# EAGLE design rso (EAGLE 9.4.2)
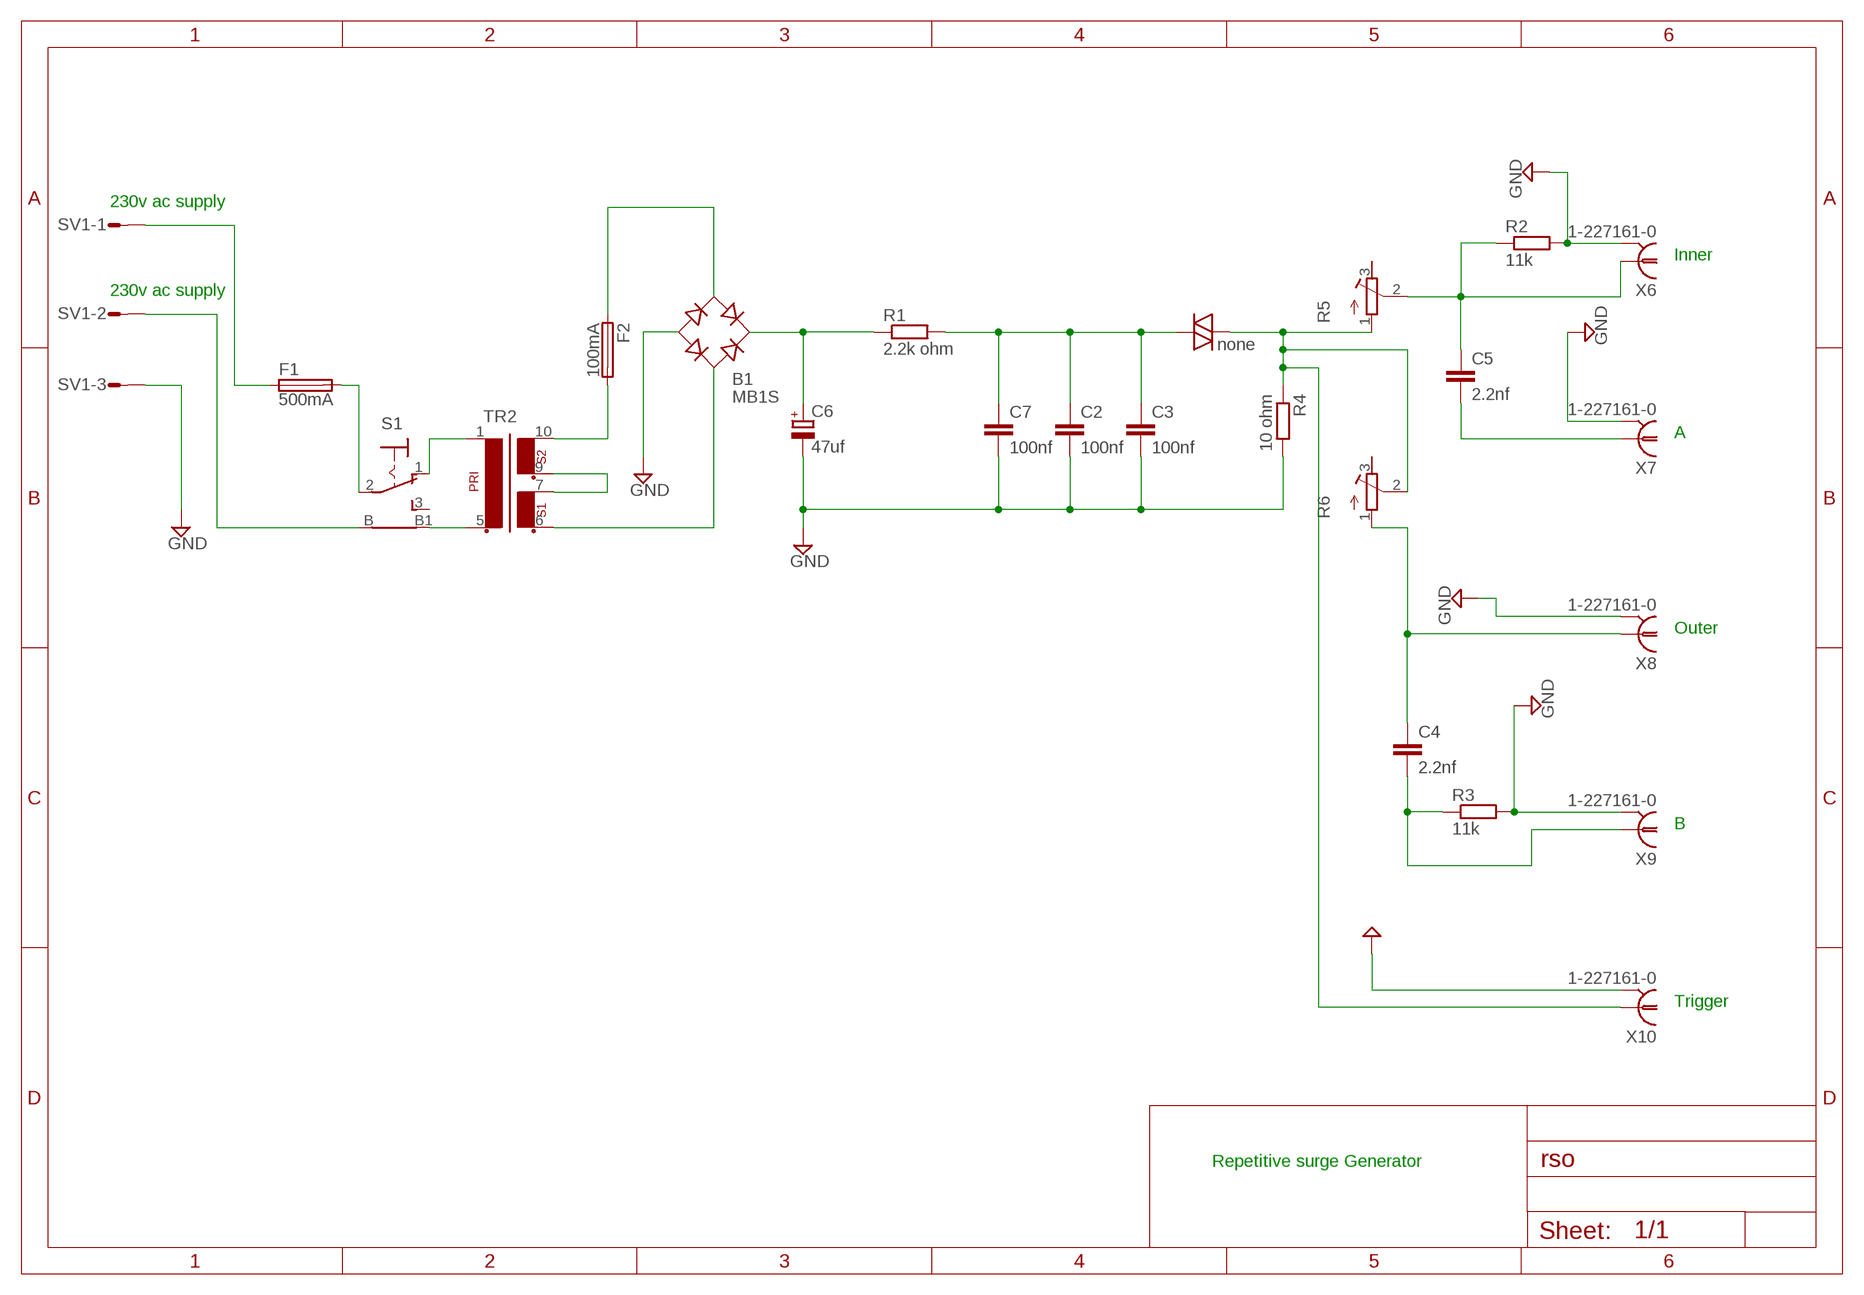
[diagram p0: schematic, sheet 1]

## Parts
B1  MB1S  [SOIC-4]
C2  100nf  C-EUC0805  [C0805]
C3  100nf  C-EUC0805  [C0805]
C4  2.2nf  C-EUC0805  [C0805]
C5  2.2nf  C-EUC0805  [C0805]
C6  47uf  CPOL-EU140CLH-1010  [140CLH-1010]
C7  100nf  C-EUC0805  [C0805]
D1  none  DIAC-DO35-10  [DO35-10]
F1  500mA  SH22,5A  [SH22,5A]
F2  100mA  SH22,5A  [SH22,5A]
R1  2.2k ohm  R-EU_R2512W  [R2512W]
R2  11k  R-EU_M0805  [M0805]
R3  11k  R-EU_M0805  [M0805]
R4  10 ohm  R-EU_M0805  [M0805]
R5  R-TRIMM3339P  [RTRIM3339P]
R6  R-TRIMM3339P  [RTRIM3339P]
S1  LPV-1  [LPV-1]
SV1  L03P  [L03P]
TR2  EI38-2  [EI38-2]
X6  1-227161-0  [AMP_227161]
X7  1-227161-0  [AMP_227161]
X8  1-227161-0  [AMP_227161]
X9  1-227161-0  [AMP_227161]
X10  1-227161-0  [AMP_227161]

## Nets
GND: B1.- C2.2 C3.2 C6.- C7.2 R2.2 R3.2 R4.2 SV1.3 X6.2 X7.2 X8.2 X9.2 X10.2
N$1: B1.~1(AC1) F2.1
N$2: B1.~2(AC2) TR2.6
N$3: TR2.7 TR2.9
N$4: S1.B SV1.2
N$5: F1.1 SV1.1
N$6: F1.2 S1.2(P)
N$7: S1.B1 TR2.5
N$8: S1.1(O) TR2.1
N$9: B1.+ C6.+ R1.1
N$10: C4.2 R3.1 X9.1
N$11: C2.1 C3.1 C7.1 D1.A R1.2
N$12: D1.C R4.1 R5.1(A) R6.2(S) X10.1
N$13: C4.1 R6.1(A) X8.1
N$14: C5.1 R2.1 R5.2(S) X6.1
N$15: C5.2 X7.1
N$16: F2.2 TR2.10
Unconnected: R5.3(E) R6.3(E) S1.3(S)

## Notes on the sheet
- 230v ac supply
- Inner
- 230v ac supply
- A
- Outer
- B
- Trigger
- Repetitive surge Generator

## Library data of the parts
B1 = rectifier:MB*S: Bridge Rectifier Source: http://www.fairchildsemi.com/ds/MB/MB6S.pdf; MF: MULTICOMP; MPN: MB1S; OC_FARNELL: 1861514
C2 C3 C7 = rcl:C-EU: CAPACITOR, European symbol; MF: AVX; MPN: 08055C104KAZ2A; OC_FARNELL: 7569564; SPICEPREFIX: C
C4 C5 = rcl:C-EU: CAPACITOR, European symbol; MF: AVX; MPN: 04025C222JAT2A; OC_FARNELL: 1740585; SPICEPREFIX: C
C6 = rcl:CPOL-EU: POLARIZED CAPACITOR, European symbol; MF: PANASONIC; MPN: EEEFK1K470P; OC_FARNELL: 9696105; SPICEPREFIX: C
D1 = diode:DIAC-: DIAC; MF: NTE ELECTRONICS; MPN: NTE6408; OC_FARNELL: 1530937
F1 F2 = fuse:SH22,5A: FUSE HOLDER grid 22,5mm, isolated cap OGN0031 8201, Schurter (Buerklin); MF: ARCOLECTRIC; MPN: C0345RAAAA; OC_FARNELL: 149862; OC_NEWARK: 04F1224
R1 = rcl:R-EU_: RESISTOR, European symbol; MF: VISHAY; MPN: CRCW08052K20FKEA; OC_FARNELL: 1469887; RS_NUMBER: 178-1862; SPICEPREFIX: R
R2 R3 = rcl:R-EU_: RESISTOR, European symbol; MF: MULTICOMP; MPN: MCMR08X1102FTL; OC_FARNELL: 2073617RL; SPICEPREFIX: R
R4 = rcl:R-EU_: RESISTOR, European symbol; MF: BOURNS; MPN: CRT1206-BY-10R0ELF; OC_FARNELL: 2008318; SPICEPREFIX: R
R5 R6 = rcl:R-TRIMM: Trimm resistor; MF: VISHAY; MPN: 534B1101JL; OC_FARNELL: 1144784; SPICEMODEL: X; SPICEPREFIXL: POT
S1 = switch:LPV-1: TOGGLE SWITCH; MF: QUALTEK ELECTRONICS; MPN: 761-18/003; OC_FARNELL: 1425202
SV1 = con-amp-mt:L03P: AMP MT CONNECTOR; MF: JST (JAPAN SOLDERLESS TERMINALS); MPN: B03B-XASK-1(LF)(SN); OC_FARNELL: 9492070; OC_NEWARK: unknown
TR2 = trafo:EI38-2: TRANSFORMER 1 primary winding, 2 secondary windings ERA; MF: MYRRA; MPN: 44203; OC_FARNELL: 1214596
X6-X10 = con-coax:?227161*: JACK, RIGHT ANGLE, 50 OHM, PCB, BNC Source: amp_227161.pdf; MF: GREENPAR - TE CONNECTIVITY; MPN: 1-1337542-0; OC_FARNELL: 1020954; OC_NEWARK: 33B3200

## Net classes
0 default: clearance 0.205 mm

## Board
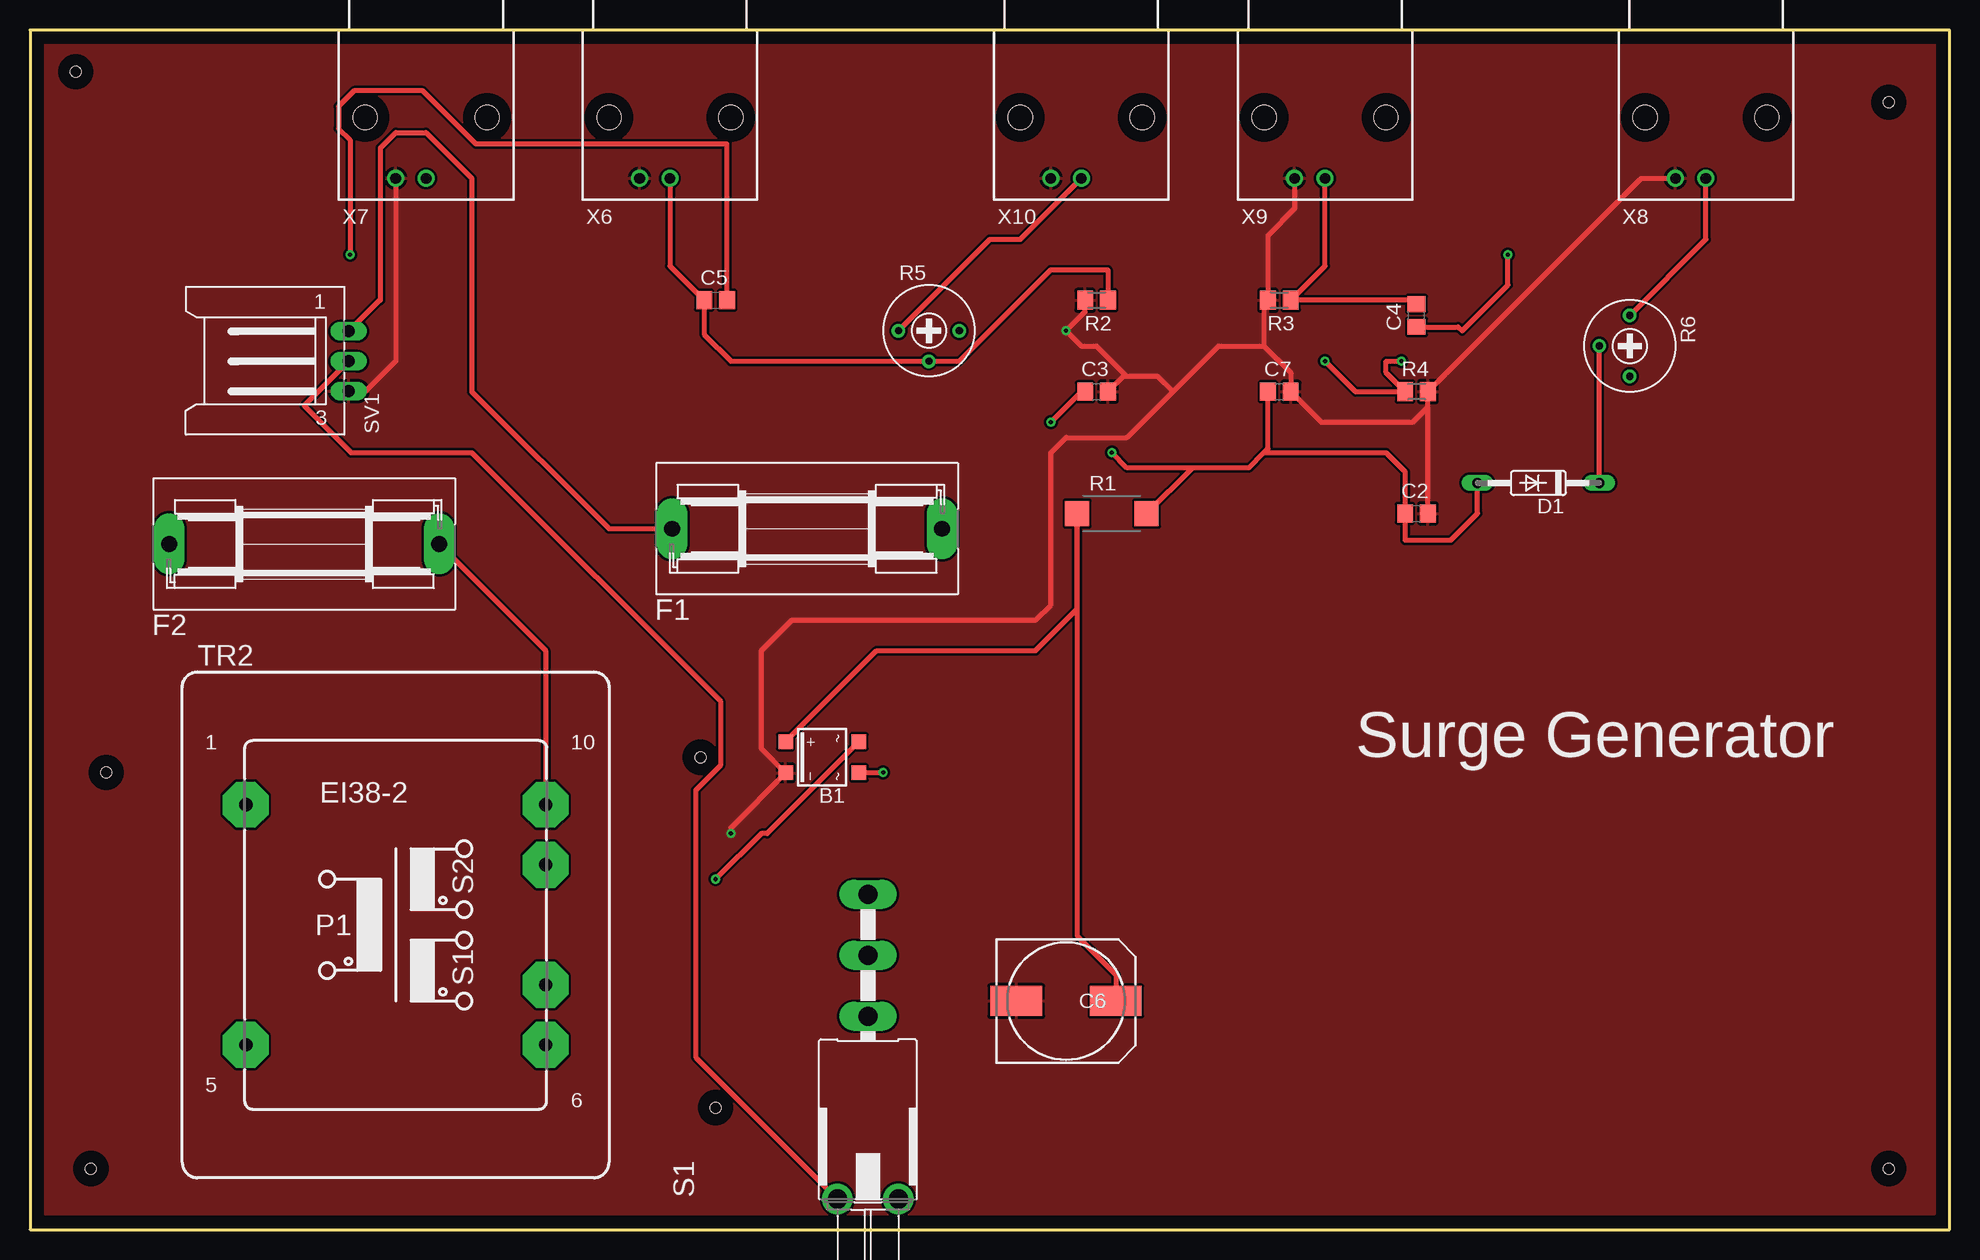
[diagram p1: board, top side]
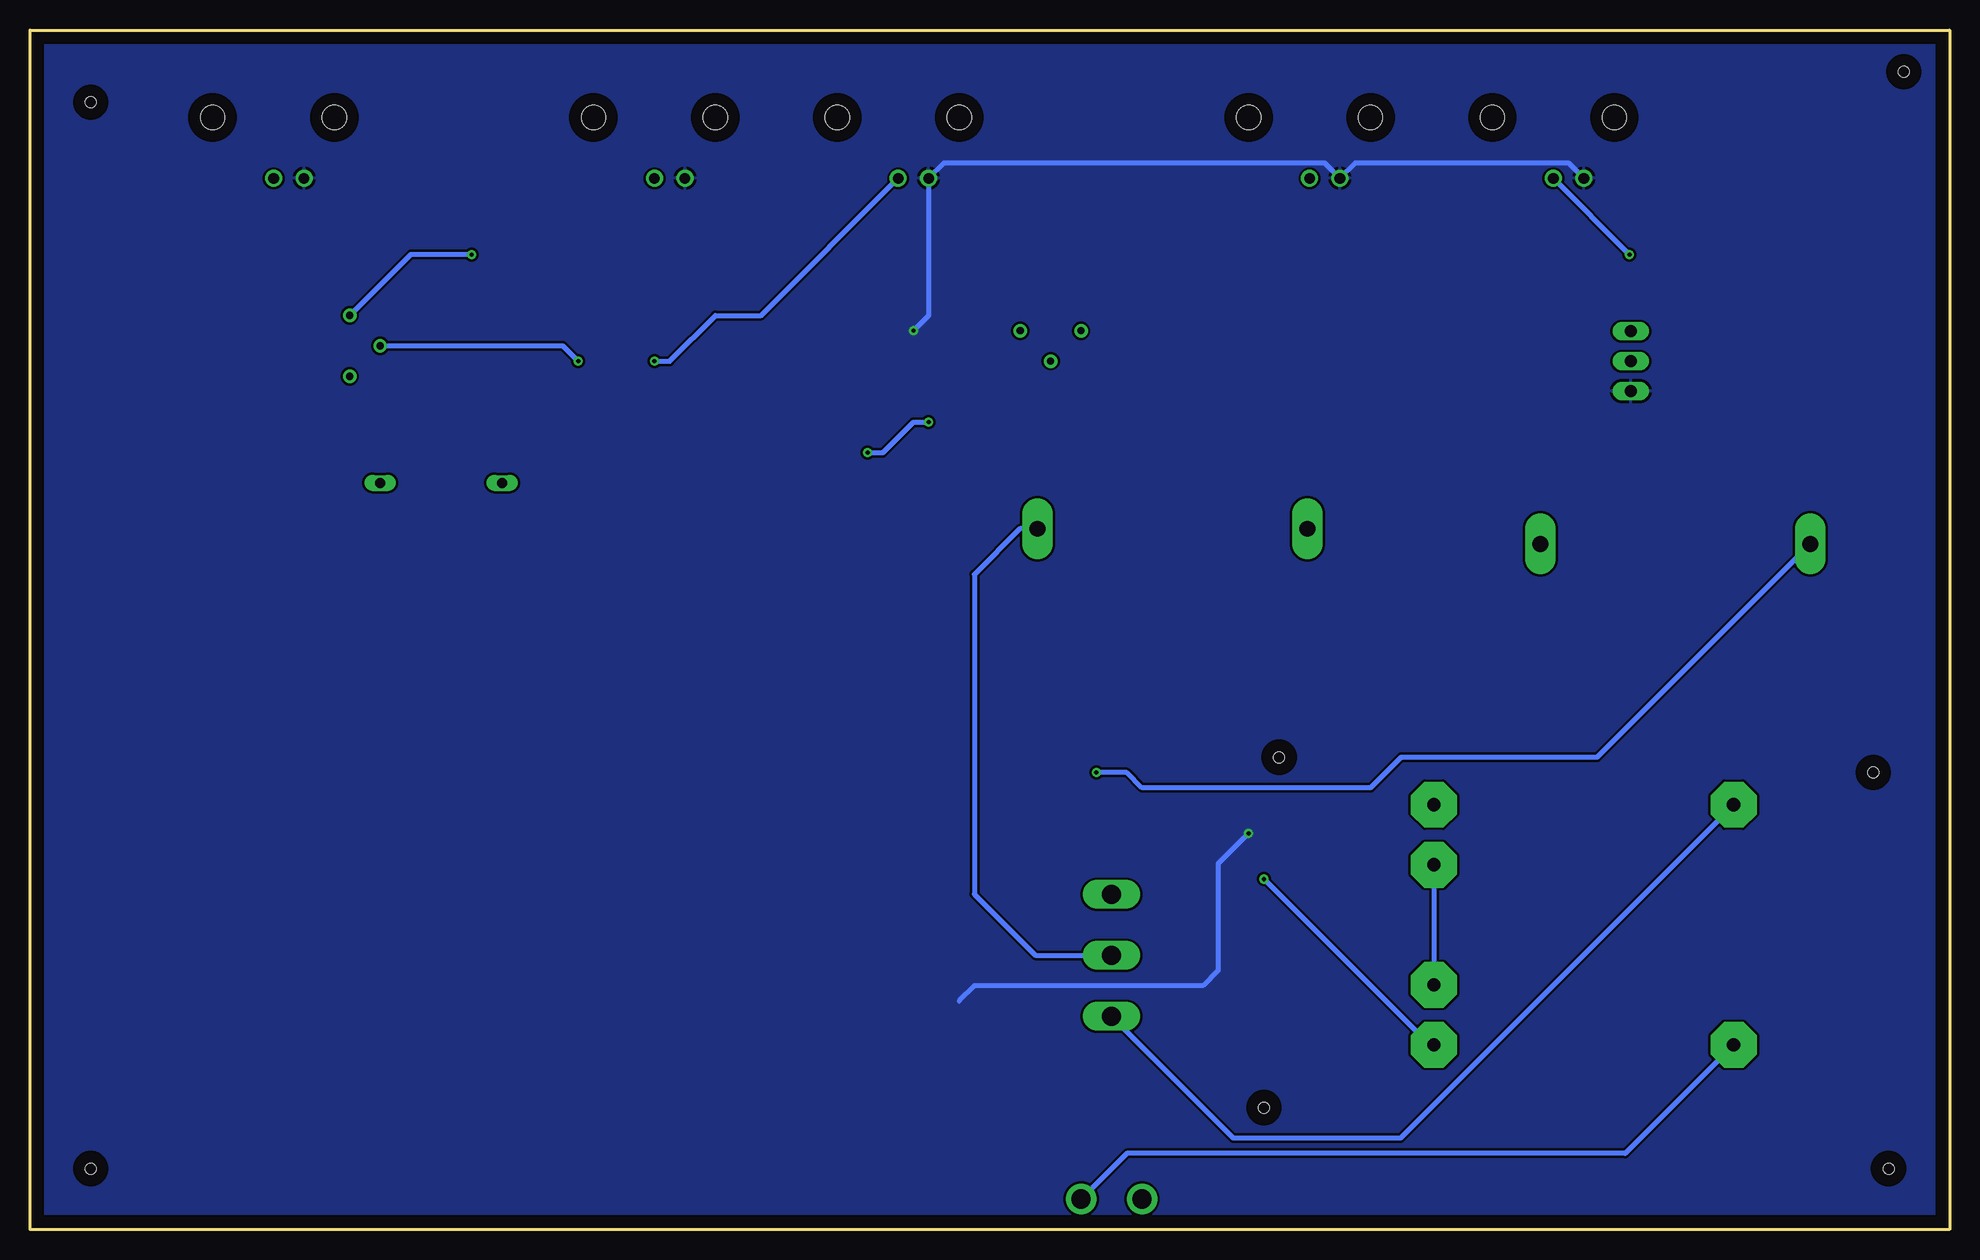
[diagram p2: board, bottom side, seen from below]

Size 160 x 100 mm. Coordinates in mm from the lower left corner, seen from the top.
Outline: 0,0 160,0 160,100 0,100 0,0
Copper layers (1*16): Top 0.035mm / dielectric 1.5mm / Bottom 0.035mm
Design rules "default *": minimum track width 16mil, minimum drill 0.35mm, track to track 6mil, track to pad 6mil, pad to pad 6mil, via to via 6mil, smd to smd 6mil, copper to edge 40mil, drill to drill 6mil, minimum pad ring 10mil, minimum via ring 8mil, stop-mask expansion 4mil, vias tented up to drill 0mil, thermal gap 10mil
Holes 0.9 mm at 5.08,5.08 3.81,96.52 154.94,5.08 154.94,93.98 55.88,39.37 57.15,10.16 6.35,38.1

### Footprints (pad centres in the part's own frame; a part is rotated, then mirrored left to right if it is on the bottom)
SOIC-4 = smd 1.2 x 1.2: + 1.3,3.05; - -1.3,3.05; ~1 -1.3,-3.05; ~2 1.3,-3.05
C0805 = smd 1.3 x 1.5: 1 -0.95,0; 2 0.95,0
140CLH-1010 = smd 4.3 x 2.5: + 4.15,0; - -4.15,0
DO35-10 = drill 0.813 long: A 5.08,0; C -5.08,0
SH22,5A = drill 1.321 pad 2.54 long: 1 -11.252,0; 2 11.252,0
R2512W = smd 2 x 2.1: 1 -2.896,0; 2 2.896,0
M0805 = smd 1.3 x 1.6: 1 -0.95,0; 2 0.95,0
RTRIM3339P = drill 0.61: 1 -2.54,0; 2 0,-2.54; 3 2.54,0
LPV-1 = drill 1.6 long: 1 0,15.24; 2 0,20.32; 3 0,25.4 | drill 1.6 pad 2.54: B -2.54,0; B1 2.54,0
L03P = drill 1.016 long: 1 2.5,-6.25; 2 0,-6.25; 3 -2.5,-6.25
EI38-2 = drill 1.118 pad 3.81 octagon: 1 -12.497,10.008; 5 -12.497,-10.008; 6 12.497,-10.008; 7 12.497,-5.004; 9 12.497,5.004; 10 12.497,10.008
AMP_227161 = drill 0.9 pad 1.27: 1 0,-5.08; 2 -2.54,-5.08 | hole 2: -5.08,0; 5.08,0

### Placement (x,y rotation side)
B1  66.04,39.37 90 top
C2  115.57,59.69 0 top
C3  88.9,69.85 0 top
C4  115.57,76.2 90 top
C5  57.15,77.47 0 top
C6  86.36,19.05 0 top
C7  104.14,69.85 0 top
D1  125.73,62.23 180 top
F1  64.77,58.42 0 top
F2  22.86,57.15 0 top
R1  90.17,59.69 0 top
R2  88.9,77.47 180 top
R3  104.14,77.47 180 top
R4  115.57,69.85 0 top
R5  74.93,74.93 0 top
R6  133.35,73.66 270 top
S1  69.85,2.54 0 top
SV1  20.32,72.39 90 top
TR2  30.48,25.4 0 top
X6  53.34,92.71 0 top
X7  33.02,92.71 0 top
X8  139.7,92.71 0 top
X9  107.95,92.71 0 top
X10  87.63,92.71 0 top

### Tracks (layer width: path | path; a pad name or v marks a point on that pad's centre or on a via)
GND  (via drill 0.35)
  Top 0.406: SV1.3 26.61,69.85 27.94,69.85 30.48,72.39 X7.2 | 95.25,69.85 93.98,71.12 91.44,71.12 | C3.2 91.12,71.12 91.44,71.12 | C2.2 116.52,68.58 | 116.52,68.58 R4.2 134.3,87.63 X8.2 | X9.2 105.41,85.09 103.19,82.87 R3.2 102.87,77.15 102.87,73.66 | 102.87,73.66 105.09,71.44 C7.2 107.63,67.31 115.25,67.31 116.52,68.58 | R2.2 87.95,76.52 v86.36,74.93 87.63,73.66 88.9,73.66 91.44,71.12 | 95.25,69.85 91.44,66.04 86.36,66.04 85.09,64.77 85.09,52.07 83.82,50.8 63.5,50.8 60.96,48.26 60.96,40.1 B1.- 58.42,33.5 v58.42,33.02 | 95.25,69.85 99.06,73.66 102.87,73.66
  Bottom 0.406: v58.42,33.02 60.96,30.48 60.96,21.59 62.23,20.32 81.28,20.32 82.55,19.05 | X7.2 31.75,88.9 49.53,88.9 X6.2 52.07,88.9 83.82,88.9 X10.2 85.09,76.2 v86.36,74.93
  pour Top (isolate 0.254): 1.27,99.06 158.75,99.06 158.75,1.27 1.27,1.27
  pour Bottom: 1.27,99.06 1.27,1.27 158.75,1.27 158.75,99.06
  pour Top: 1.27,99.06 1.27,1.27 158.75,1.27 158.75,99.06
N$1  (via drill 0.35)
  Top 0.406: v71.12,38.1 71.09,38.07 B1.~1
  Bottom 0.406: F2.1 29.39,39.37 45.72,39.37 48.26,36.83 67.31,36.83 68.58,38.1 v71.12,38.1
N$2  (via drill 0.35)
  Top 0.406: v57.15,29.21 60.96,33.02 61.44,33.02 B1.~2
  Bottom 0.406: TR2.6 43.33,15.39 v57.15,29.21
N$3
  Bottom 0.406: TR2.9 TR2.7
N$4
  Top 0.406: SV1.2 22.86,68.68 26.77,64.77 36.83,64.77 57.55,44.05 57.55,38.68 55.48,36.61 55.48,14.37 S1.B
N$5
  Top 0.406: SV1.1 29.15,77.47 29.21,77.47 29.21,90.17 30.48,91.44 33.02,91.44 36.83,87.63 36.83,69.85 48.26,58.42 F1.1
N$6
  Bottom 0.406: F1.2 77.47,58.42 81.28,54.61 81.28,27.94 76.2,22.86 S1.2
N$7
  Bottom 0.406: TR2.5 27.03,6.35 68.58,6.35 S1.B1
N$8
  Bottom 0.406: S1.1 59.69,7.62 45.77,7.62 TR2.1
N$9
  Top 0.406: B1.+ 70.58,48.26 83.82,48.26 87.27,51.71 R1.1 87.27,24.49 90.51,21.25 C6.+
N$10
  Top 0.406: C4.2 115.25,77.47 R3.1 107.95,80.33 X9.1
N$11  (via drill 0.35)
  Top 0.406: R1.2 96.88,63.5 | 96.88,63.5 101.6,63.5 102.87,64.77 | 102.87,64.77 103.19,65.09 C7.1 | 102.87,64.77 113.03,64.77 114.62,63.18 C2.1 114.62,57.46 118.42,57.46 120.65,59.69 D1.A | 96.88,63.5 91.44,63.5 v90.17,64.77 | v85.09,67.31 87.63,69.85 C3.1
  Bottom 0.406: v90.17,64.77 88.9,64.77 86.36,67.31 v85.09,67.31
N$12  (via drill 0.35)
  Top 0.406: R5.1 80.01,82.55 82.55,82.55 X10.1 | D1.C R6.2 | v107.95,72.39 110.49,69.85 R4.1 113.03,71.44 113.03,72.39 v114.3,72.39
  Bottom 0.406: v107.95,72.39 106.68,72.39 102.87,76.2 99.06,76.2 X10.1 | v114.3,72.39 115.57,73.66 R6.2
N$13  (via drill 0.35)
  Top 0.406: C4.1 119.06,75.25 119.38,74.93 123.19,78.74 v123.19,81.28 | R6.1 139.7,82.55 X8.1
  Bottom 0.406: v123.19,81.28 128.27,81.28 R6.1
N$14
  Top 0.406: R2.1 89.85,80.01 85.09,80.01 77.47,72.39 R5.2 58.42,72.39 56.2,74.61 C5.1 53.34,80.33 X6.1
N$15  (via drill 0.35)
  Top 0.406: C5.2 58.1,90.49 37.18,90.49 32.74,94.93 27.02,94.93 25.72,93.63 25.72,91.79 26.67,90.84 v26.67,81.28
  Bottom 0.406: v26.67,81.28 X7.1
N$16
  Top 0.406: F2.2 42.98,48.28 TR2.10

### Text on the board
tPlace: Surge Generator